# EAGLE design boardSchematic (EAGLE 9.3.0)
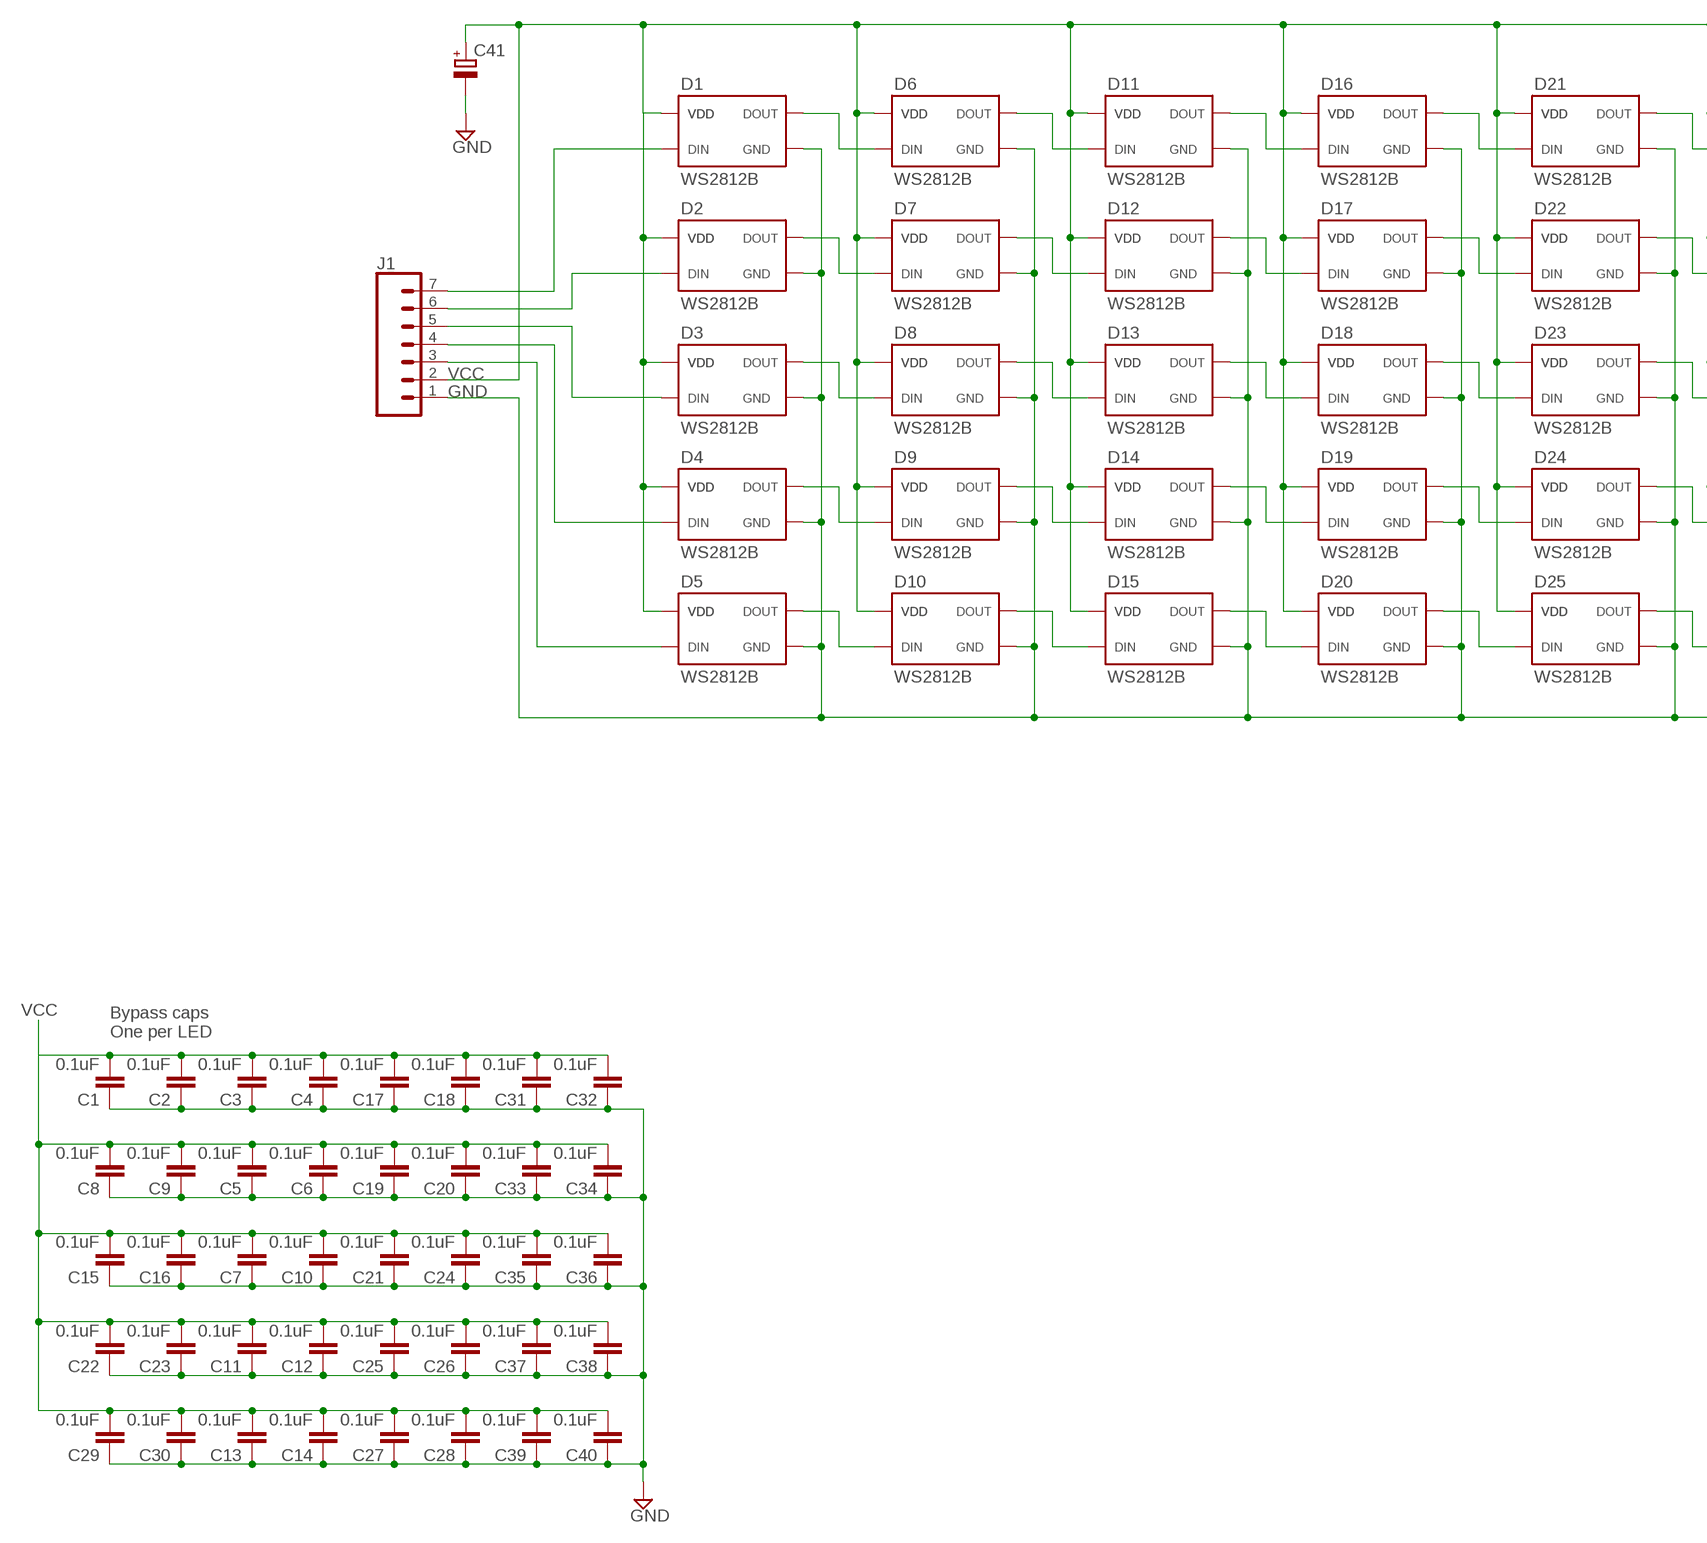
[diagram p0: schematic, sheet 1, part 1 of 2]
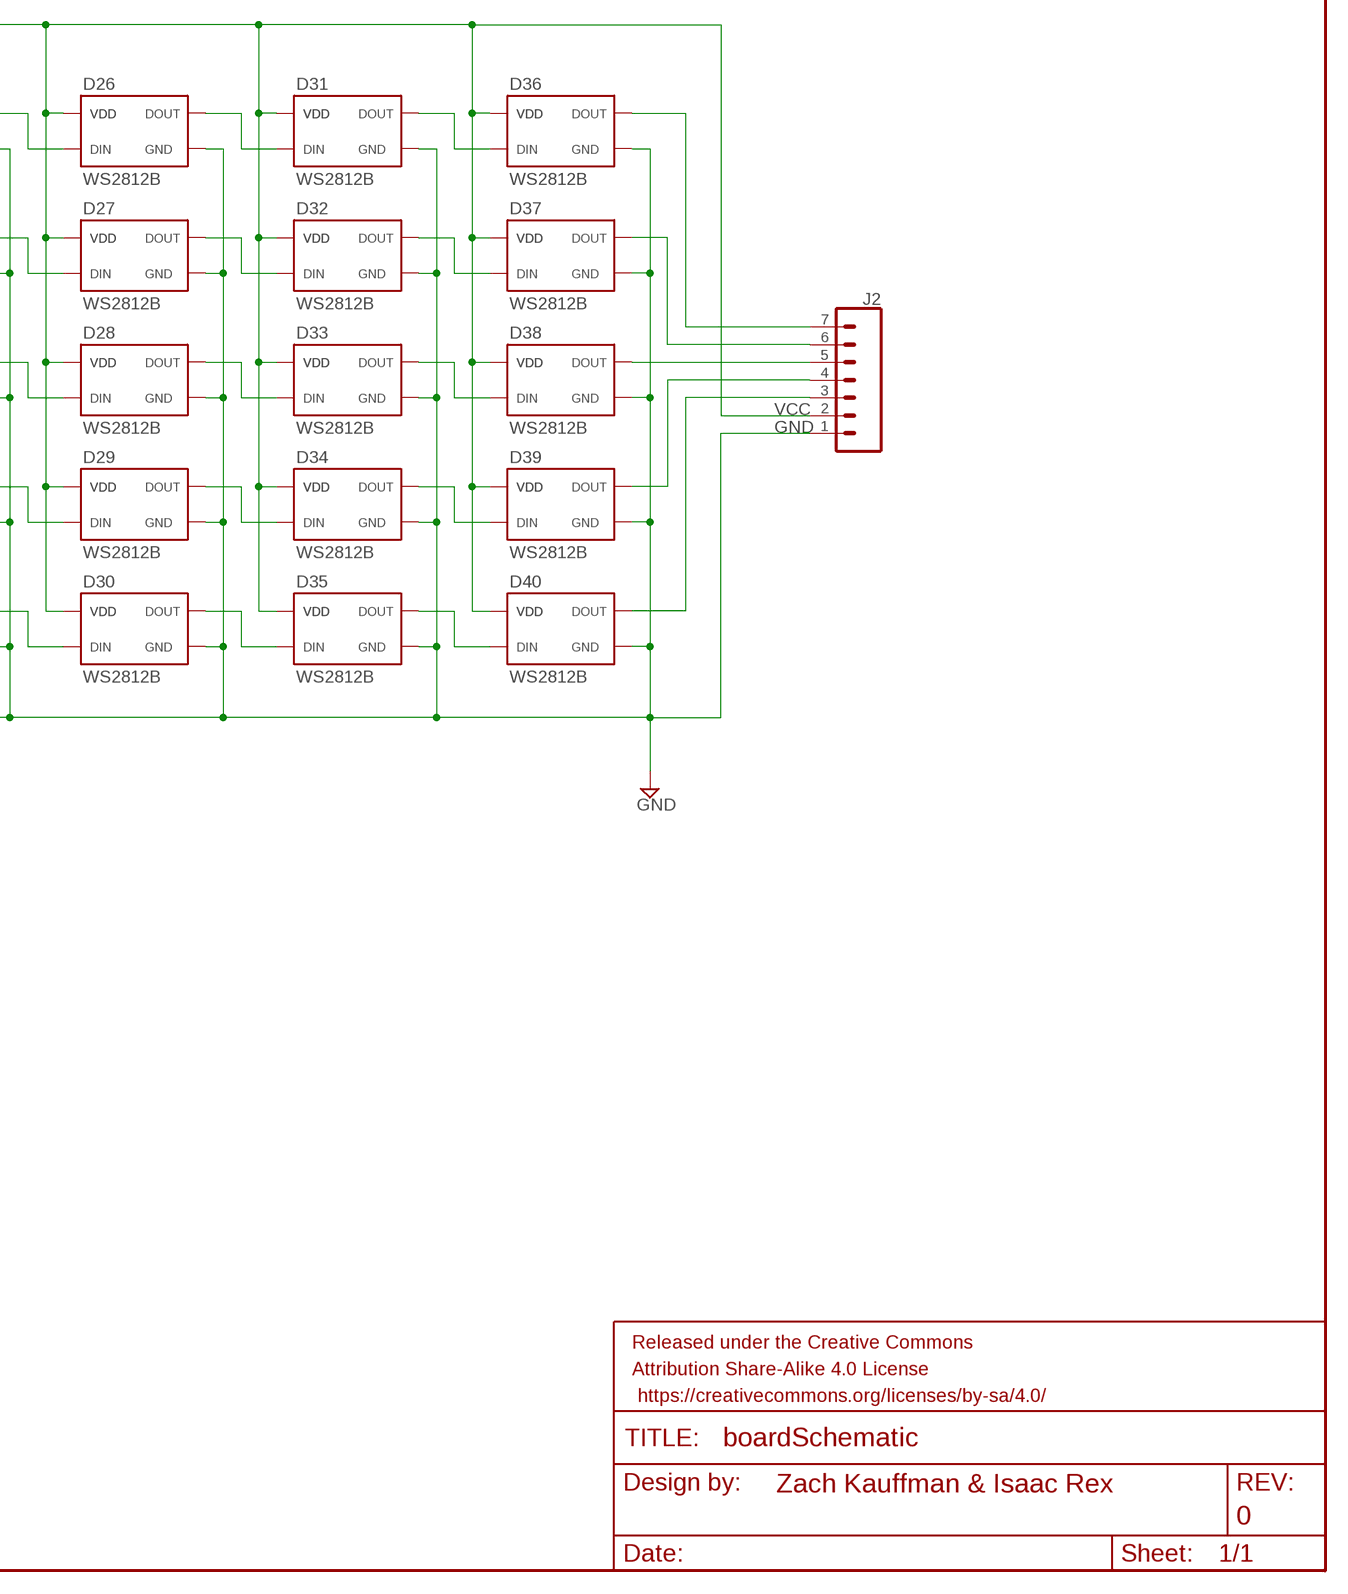
[diagram p1: schematic, sheet 1, part 2 of 2]

## Parts
C1  0.1uF  0.1UF-0603-25V-(+80/-20%)  [0603]
C2  0.1uF  0.1UF-0603-25V-(+80/-20%)  [0603]
C3  0.1uF  0.1UF-0603-25V-(+80/-20%)  [0603]
C4  0.1uF  0.1UF-0603-25V-(+80/-20%)  [0603]
C5  0.1uF  0.1UF-0603-25V-(+80/-20%)  [0603]
C6  0.1uF  0.1UF-0603-25V-(+80/-20%)  [0603]
C7  0.1uF  0.1UF-0603-25V-(+80/-20%)  [0603]
C8  0.1uF  0.1UF-0603-25V-(+80/-20%)  [0603]
C9  0.1uF  0.1UF-0603-25V-(+80/-20%)  [0603]
C10  0.1uF  0.1UF-0603-25V-(+80/-20%)  [0603]
C11  0.1uF  0.1UF-0603-25V-(+80/-20%)  [0603]
C12  0.1uF  0.1UF-0603-25V-(+80/-20%)  [0603]
C13  0.1uF  0.1UF-0603-25V-(+80/-20%)  [0603]
C14  0.1uF  0.1UF-0603-25V-(+80/-20%)  [0603]
C15  0.1uF  0.1UF-0603-25V-(+80/-20%)  [0603]
C16  0.1uF  0.1UF-0603-25V-(+80/-20%)  [0603]
C17  0.1uF  0.1UF-0603-25V-(+80/-20%)  [0603]
C18  0.1uF  0.1UF-0603-25V-(+80/-20%)  [0603]
C19  0.1uF  0.1UF-0603-25V-(+80/-20%)  [0603]
C20  0.1uF  0.1UF-0603-25V-(+80/-20%)  [0603]
C21  0.1uF  0.1UF-0603-25V-(+80/-20%)  [0603]
C22  0.1uF  0.1UF-0603-25V-(+80/-20%)  [0603]
C23  0.1uF  0.1UF-0603-25V-(+80/-20%)  [0603]
C24  0.1uF  0.1UF-0603-25V-(+80/-20%)  [0603]
C25  0.1uF  0.1UF-0603-25V-(+80/-20%)  [0603]
C26  0.1uF  0.1UF-0603-25V-(+80/-20%)  [0603]
C27  0.1uF  0.1UF-0603-25V-(+80/-20%)  [0603]
C28  0.1uF  0.1UF-0603-25V-(+80/-20%)  [0603]
C29  0.1uF  0.1UF-0603-25V-(+80/-20%)  [0603]
C30  0.1uF  0.1UF-0603-25V-(+80/-20%)  [0603]
C31  0.1uF  0.1UF-0603-25V-(+80/-20%)  [0603]
C32  0.1uF  0.1UF-0603-25V-(+80/-20%)  [0603]
C33  0.1uF  0.1UF-0603-25V-(+80/-20%)  [0603]
C34  0.1uF  0.1UF-0603-25V-(+80/-20%)  [0603]
C35  0.1uF  0.1UF-0603-25V-(+80/-20%)  [0603]
C36  0.1uF  0.1UF-0603-25V-(+80/-20%)  [0603]
C37  0.1uF  0.1UF-0603-25V-(+80/-20%)  [0603]
C38  0.1uF  0.1UF-0603-25V-(+80/-20%)  [0603]
C39  0.1uF  0.1UF-0603-25V-(+80/-20%)  [0603]
C40  0.1uF  0.1UF-0603-25V-(+80/-20%)  [0603]
C41  CPOL-EUE2-5  [E2-5]
D1  WS2812B  [5050]
D2  WS2812B  [5050]
D3  WS2812B  [5050]
D4  WS2812B  [5050]
D5  WS2812B  [5050]
D6  WS2812B  [5050]
D7  WS2812B  [5050]
D8  WS2812B  [5050]
D9  WS2812B  [5050]
D10  WS2812B  [5050]
D11  WS2812B  [5050]
D12  WS2812B  [5050]
D13  WS2812B  [5050]
D14  WS2812B  [5050]
D15  WS2812B  [5050]
D16  WS2812B  [5050]
D17  WS2812B  [5050]
D18  WS2812B  [5050]
D19  WS2812B  [5050]
D20  WS2812B  [5050]
D21  WS2812B  [5050]
D22  WS2812B  [5050]
D23  WS2812B  [5050]
D24  WS2812B  [5050]
D25  WS2812B  [5050]
D26  WS2812B  [5050]
D27  WS2812B  [5050]
D28  WS2812B  [5050]
D29  WS2812B  [5050]
D30  WS2812B  [5050]
D31  WS2812B  [5050]
D32  WS2812B  [5050]
D33  WS2812B  [5050]
D34  WS2812B  [5050]
D35  WS2812B  [5050]
D36  WS2812B  [5050]
D37  WS2812B  [5050]
D38  WS2812B  [5050]
D39  WS2812B  [5050]
D40  WS2812B  [5050]
FRAME1  FRAME-LEDGER  [CREATIVE_COMMONS]
J1  CONN_07LOCK_LONGPADS  [1X07_LOCK_LONGPADS]
J2  CONN_07LOCK_LONGPADS  [1X07_LOCK_LONGPADS]

## Nets
GND: C1.1 C2.1 C3.1 C4.1 C5.1 C6.1 C7.1 C8.1 C9.1 C10.1 C11.1 C12.1 C13.1 C14.1 C15.1 C16.1 C17.1 C18.1 C19.1 C20.1 C21.1 C22.1 C23.1 C24.1 C25.1 C26.1 C27.1 C28.1 C29.1 C30.1 C31.1 C32.1 C33.1 C34.1 C35.1 C36.1 C37.1 C38.1 C39.1 C40.1 C41.- D1.VSS(GND) D2.VSS(GND) D3.VSS(GND) D4.VSS(GND) D5.VSS(GND) D6.VSS(GND) D7.VSS(GND) D8.VSS(GND) D9.VSS(GND) D10.VSS(GND) D11.VSS(GND) D12.VSS(GND) D13.VSS(GND) D14.VSS(GND) D15.VSS(GND) D16.VSS(GND) D17.VSS(GND) D18.VSS(GND) D19.VSS(GND) D20.VSS(GND) D21.VSS(GND) D22.VSS(GND) D23.VSS(GND) D24.VSS(GND) D25.VSS(GND) D26.VSS(GND) D27.VSS(GND) D28.VSS(GND) D29.VSS(GND) D30.VSS(GND) D31.VSS(GND) D32.VSS(GND) D33.VSS(GND) D34.VSS(GND) D35.VSS(GND) D36.VSS(GND) D37.VSS(GND) D38.VSS(GND) D39.VSS(GND) D40.VSS(GND) J1.1 J2.1
N$1: D5.DOUT D10.DIN
N$2: D5.DIN J1.3
N$3: D4.DOUT D9.DIN
N$4: D1.DOUT D6.DIN
N$5: D10.DOUT D15.DIN
N$6: D2.DOUT D7.DIN
N$7: D3.DOUT D8.DIN
N$9: D9.DOUT D14.DIN
N$10: D6.DOUT D11.DIN
N$11: D7.DOUT D12.DIN
N$12: D8.DOUT D13.DIN
N$13: D4.DIN J1.4
N$14: D15.DOUT D20.DIN
N$15: D3.DIN J1.5
N$16: D14.DOUT D19.DIN
N$17: D11.DOUT D16.DIN
N$18: D12.DOUT D17.DIN
N$19: D13.DOUT D18.DIN
N$20: D2.DIN J1.6
N$21: D20.DOUT D25.DIN
N$22: D1.DIN J1.7
N$23: D19.DOUT D24.DIN
N$24: D16.DOUT D21.DIN
N$25: D17.DOUT D22.DIN
N$26: D18.DOUT D23.DIN
N$27: D37.DOUT J2.6
N$28: D25.DOUT D30.DIN
N$29: D36.DOUT J2.7
N$30: D24.DOUT D29.DIN
N$31: D21.DOUT D26.DIN
N$32: D22.DOUT D27.DIN
N$33: D23.DOUT D28.DIN
N$34: D38.DOUT J2.5
N$35: D30.DOUT D35.DIN
N$36: D39.DOUT J2.4
N$37: D29.DOUT D34.DIN
N$38: D26.DOUT D31.DIN
N$39: D27.DOUT D32.DIN
N$40: D28.DOUT D33.DIN
N$41: D40.DOUT J2.3
N$42: D35.DOUT D40.DIN
N$45: D34.DOUT D39.DIN
N$46: D31.DOUT D36.DIN
N$47: D32.DOUT D37.DIN
N$48: D33.DOUT D38.DIN
VCC: C1.2 C2.2 C3.2 C4.2 C5.2 C6.2 C7.2 C8.2 C9.2 C10.2 C11.2 C12.2 C13.2 C14.2 C15.2 C16.2 C17.2 C18.2 C19.2 C20.2 C21.2 C22.2 C23.2 C24.2 C25.2 C26.2 C27.2 C28.2 C29.2 C30.2 C31.2 C32.2 C33.2 C34.2 C35.2 C36.2 C37.2 C38.2 C39.2 C40.2 C41.+ D1.VDD D2.VDD D3.VDD D4.VDD D5.VDD D6.VDD D7.VDD D8.VDD D9.VDD D10.VDD D11.VDD D12.VDD D13.VDD D14.VDD D15.VDD D16.VDD D17.VDD D18.VDD D19.VDD D20.VDD D21.VDD D22.VDD D23.VDD D24.VDD D25.VDD D26.VDD D27.VDD D28.VDD D29.VDD D30.VDD D31.VDD D32.VDD D33.VDD D34.VDD D35.VDD D36.VDD D37.VDD D38.VDD D39.VDD D40.VDD J1.2 J2.2

## Notes on the sheet
- Bypass caps
  One per LED

## Library data of the parts
C1-C40 = SparkFun-Capacitors:0.1UF: 0.1µF ceramic capacitors A capacitor is a passive two-terminal electrical component used to store electrical energy temporarily in an electric field.; PROD_ID: CAP-00810
C41 = rcl:CPOL-EU: POLARIZED CAPACITOR, European symbol; SPICEPREFIX: C
D1-D40 = WS2812b:WS2812B
FRAME1 = SparkFun-Aesthetics:FRAME-LEDGER: Schematic Frame - Ledger Standard 11x14 US Ledger frame; DESIGNER: Zach Kauffman & Isaac Rex; REV: 0
J1 J2 = SparkFun-Connectors:CONN_07: Multi connection point. Often used as Generic Header-pin footprint for 0.1 inch spaced/style header connections On any of the 0.1 inch spaced packages, you can populate with these: Break Away Headers - Straight <https://www.sparkfun.com/products/116> (PRT-00116) Break Away Male Headers - Right Angle <https://www.sparkfun.com/products/553> (PRT-00553) Female Headers <https://www.sparkfun.com/products/115> (PRT-00115) Break Away Headers - Machine Pin <https://www.sparkfun.com/products/117> (PRT-00117) Break Away Female Headers - Swiss Machine Pin <https://www.sparkfun.com/products/743> (PRT-00743) For SCREWTERMINALS and SPRING TERMINALS visit here: Screw Terimnals on SparkFun.com <https://www.sparkfun.com/search/results?term=Screw+Terminals> (5mm/3.5mm/2.54mm spacing) This device is also useful as a general connection point to wire up your design to another part of your project. Our various solder wires solder well into these plated through hole pads. Hook-Up Wire - Assortment (Stranded, 22 AWG) <https://www.sparkfun.com/products/11375> (PRT-11375) Hook-Up Wire - Assortment (Solid Core, 22 AWG) <https://www.sparkfun.com/products/11367> (PRT-11367) View the entire wire category on our website here <https://www.sparkfun.com/categories/141> Special notes: Molex polarized connector foot print use with SKU : PRT-08231 with associated crimp pins and housings. 1MM SMD Version SKU: PRT-10208 NOTES ON THE VARIANTS LOCK and LOCK_LONGPADS... This footprint was designed to help hold the alignment of a through-hole component (i.e. 6-pin header) while soldering it into place. You may notice that each hole has been shifted either up or down by 0.005 of an inch from it's more standard position (which is a perfectly straight line). This slight alteration caused the pins (the squares in the middle) to touch the edges of the holes. Because they are alternating, it causes a "brace" to hold the component in place. 0.005 has proven to be the perfect amount of "off-center" position when using our standard breakaway headers. Although looks a little odd when you look at the bare footprint, once you have a header in there, the alteration is very hard to notice. Also,if you push a header all the way into place, it is covered up entirely on the bottom side.

## Board
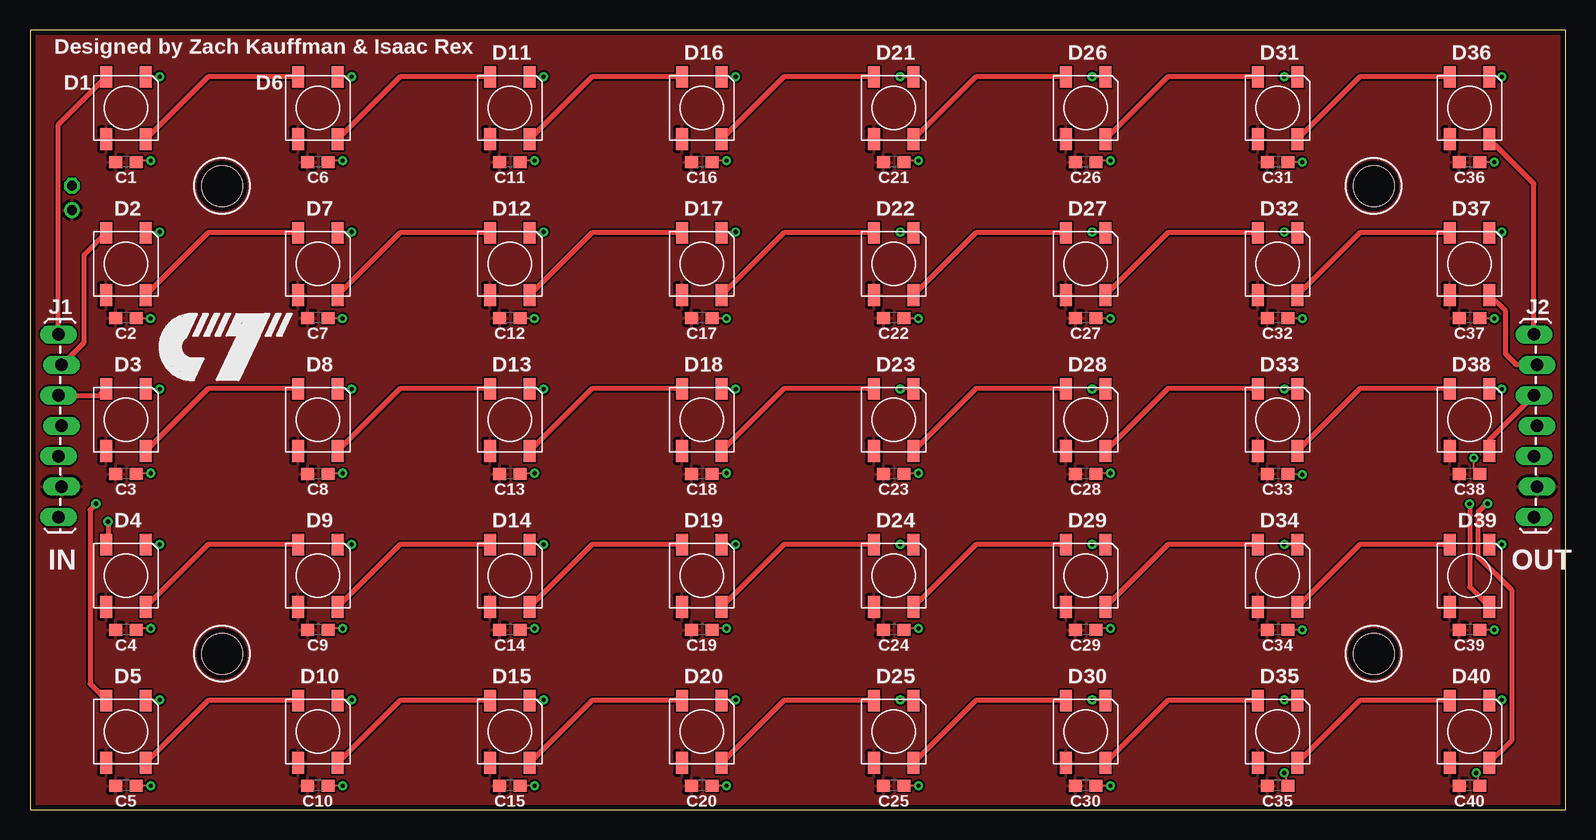
[diagram p2: board, top side]
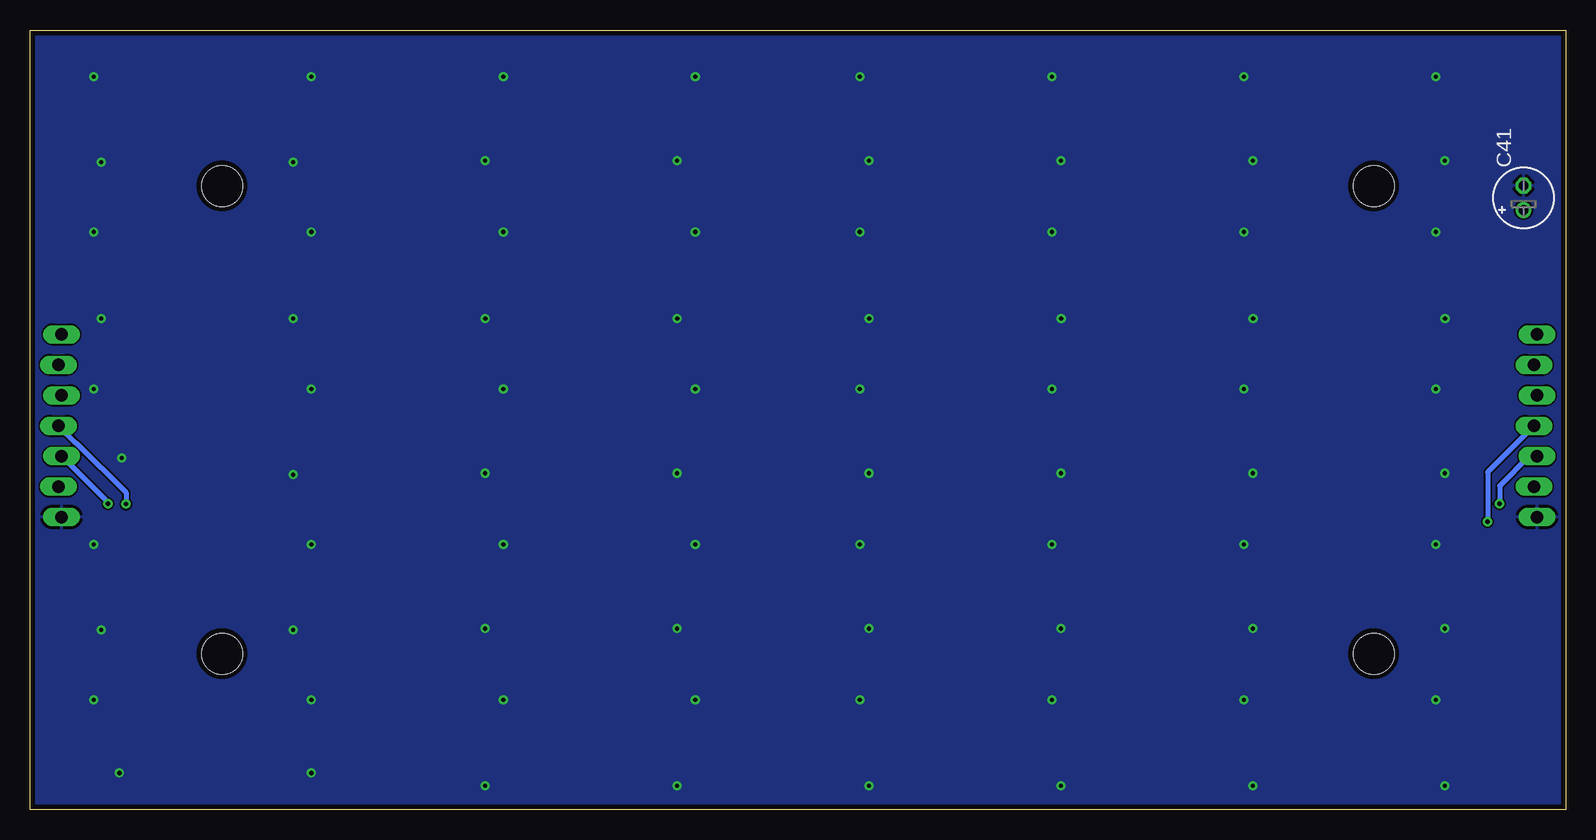
[diagram p3: board, bottom side, seen from below]

Size 128 x 65 mm. Coordinates in mm from the lower left corner, seen from the top.
Outline: 0,0 128,0 128,65 0,65 0,0
Copper layers (1*16): Top 0.035mm / dielectric 1.5mm / Bottom 0.035mm
Design rules "default *": minimum track width 6mil, minimum drill 0.35mm, track to track 6mil, track to pad 6mil, pad to pad 6mil, via to via 6mil, smd to smd 6mil, copper to edge 16mil, drill to drill 6mil, minimum pad ring 10mil, minimum via ring 8mil, stop-mask expansion 4mil, vias tented up to drill 0mil, thermal gap 10mil
Holes 3.4 mm at 16,13 16,52 112,52 112,13

### Footprints (pad centres in the part's own frame; a part is rotated, then mirrored left to right if it is on the bottom)
0603 = smd 1.1 x 1: 1 -0.85,0; 2 0.85,0
E2-5 = drill 0.813 pad 1.27: + -1.016,0 | drill 0.813 pad 1.27 octagon: - 1.016,0
5050 = smd 1.8 x 1: DIN 2.6,1.65; DOUT -2.6,-1.65; VDD -2.6,1.65; VSS 2.6,-1.65
1X07_LOCK_LONGPADS = drill 1.016 long: 1 0,0.127; 2 2.54,-0.127; 3 5.08,0.127; 4 7.62,-0.127; 5 10.16,0.127; 6 12.7,-0.127; 7 15.24,0.127

### Placement (x,y rotation side)
C1  8,54 180 top
C2  8,41 180 top
C3  8,28 180 top
C4  8,15 180 top
C5  8,2 180 top
C6  24,54 180 top
C7  24,41 180 top
C8  24,28 180 top
C9  24,15 180 top
C10  24,2 180 top
C11  40,54 180 top
C12  40,41 180 top
C13  40,28 180 top
C14  40,15 180 top
C15  40,2 180 top
C16  56,54 180 top
C17  56,41 180 top
C18  56,28 180 top
C19  56,15 180 top
C20  56,2 180 top
C21  72,54 180 top
C22  72,41 180 top
C23  72,28 180 top
C24  72,15 180 top
C25  72,2 180 top
C26  88,54 180 top
C27  88,41 180 top
C28  88,28 180 top
C29  88,15 180 top
C30  88,2 180 top
C31  104,54 180 top
C32  104,41 180 top
C33  104,28 180 top
C34  104,15 180 top
C35  104,2 180 top
C36  120,54 180 top
C37  120,41 180 top
C38  120,28 180 top
C39  120,15 180 top
C40  120,2 180 top
C41  3.5,51 90 bottom
D1  8,58.5 90 top
D2  8,45.5 90 top
D3  8,32.5 90 top
D4  8,19.5 90 top
D5  8,6.5 90 top
D6  24,58.5 90 top
D7  24,45.5 90 top
D8  24,32.5 90 top
D9  24,19.5 90 top
D10  24,6.5 90 top
D11  40,58.5 90 top
D12  40,45.5 90 top
D13  40,32.5 90 top
D14  40,19.5 90 top
D15  40,6.5 90 top
D16  56,58.5 90 top
D17  56,45.5 90 top
D18  56,32.5 90 top
D19  56,19.5 90 top
D20  56,6.5 90 top
D21  72,58.5 90 top
D22  72,45.5 90 top
D23  72,32.5 90 top
D24  72,19.5 90 top
D25  72,6.5 90 top
D26  88,58.5 90 top
D27  88,45.5 90 top
D28  88,32.5 90 top
D29  88,19.5 90 top
D30  88,6.5 90 top
D31  104,58.5 90 top
D32  104,45.5 90 top
D33  104,32.5 90 top
D34  104,19.5 90 top
D35  104,6.5 90 top
D36  120,58.5 90 top
D37  120,45.5 90 top
D38  120,32.5 90 top
D39  120,19.5 90 top
D40  120,6.5 90 top
FRAME1  -80.01,62.23 0 top  (outside the outline)
J1  2.5,24.38 90 top
J2  125.5,24.38 90 top

### Tracks (layer width: path | path; a pad name or v marks a point on that pad's centre or on a via)
GND  (via drill 0.35)
  Top 0.152: v10.06,1.98 8.99,1.98 C5.1 | v10.06,15.09 8.99,15.09 C4.1 | v26.06,1.98 24.99,1.98 C10.1 | v10.06,28.04 8.99,28.04 C3.1 | v26.06,15.09 24.99,15.09 C9.1 | v42.06,1.98 41,1.98 C15.1 | v10.04,40.93 8.92,40.93 C2.1 | v26.06,28.04 24.99,28.04 C8.1 | v42.06,15.09 41,15.09 C14.1 | v58.06,1.98 57,1.98 C20.1 | v10.06,54.1 8.99,54.1 C1.1 | v26.04,40.93 24.92,40.93 C7.1 | v42.06,28.04 41,28.04 C13.1 | v58.06,15.09 57,15.09 C19.1 | v74.07,1.98 73,1.98 C25.1 | v26.06,54.1 24.99,54.1 C6.1 | v42.04,40.93 40.92,40.93 C12.1 | v74.07,15.09 73,15.09 C24.1 | v58.06,28.04 57,28.04 C18.1 | v90.07,1.98 89,1.98 C30.1 | v42.06,54.1 41,54.1 C11.1 | v58.05,40.93 56.92,40.93 C17.1 | v90.07,15.09 89,15.09 C29.1 | v74.07,28.04 73,28.04 C23.1 | v104.55,3.05 104.7,2.9 104.7,2.13 C35.1 | v58.06,54.1 57,54.1 C16.1 | v74.05,40.93 72.92,40.93 C22.1 | v90.07,28.04 89,28.04 C28.1 | v106.05,14.97 104.88,14.97 C34.1 | v120.55,3.05 120.7,2.9 120.7,2.13 C40.1 | v74.07,54.1 73,54.1 C21.1 | v90.05,40.93 88.92,40.93 C27.1 | v122.05,14.97 120.88,14.97 C39.1 | v106.05,27.92 104.88,27.92 104.85,27.89 C33.1 | v90.07,54.1 89,54.1 C26.1 | v106.05,40.93 104.92,40.93 C32.1 | v120.35,29.32 120.35,28.5 C38.1 | v106.05,53.98 104.87,53.98 C31.1 | v122.05,40.93 120.92,40.93 C37.1 | v122.05,53.98 120.87,53.98 C36.1 | v10.82,9.14 9.75,9.14 D5.VSS | v10.82,22.1 9.75,22.1 D4.VSS | v26.82,9.14 25.76,9.14 D10.VSS | v10.82,35.05 9.75,35.05 D3.VSS | v26.82,22.1 25.76,22.1 D9.VSS | v42.82,9.14 41.76,9.14 D15.VSS | v10.82,48.16 9.75,48.16 D2.VSS | v26.82,35.05 25.76,35.05 D8.VSS | v42.82,22.1 41.76,22.1 D14.VSS | v58.83,9.14 57.76,9.14 D20.VSS | v10.82,61.11 9.75,61.11 D1.VSS | v26.82,48.16 25.76,48.16 D7.VSS
  Top 0.152: v42.82,35.05 41.76,35.05 D13.VSS | v58.83,22.1 57.76,22.1 D19.VSS | v72.54,9.14 73.61,9.14 D25.VSS | v26.82,61.11 25.76,61.11 D6.VSS | v42.82,48.16 41.76,48.16 D12.VSS | v58.83,35.05 57.76,35.05 D18.VSS | v72.54,22.1 73.61,22.1 D24.VSS | v88.54,9.14 89.61,9.14 D30.VSS | v42.82,61.11 41.76,61.11 D11.VSS | v58.83,48.16 57.76,48.16 D17.VSS | v72.54,35.05 73.61,35.05 D23.VSS | v88.54,22.1 89.61,22.1 D29.VSS | v104.55,9.14 105.61,9.14 D35.VSS | v58.83,61.11 57.76,61.11 D16.VSS | v72.54,48.16 73.61,48.16 D22.VSS | v88.54,35.05 89.61,35.05 D28.VSS | v104.55,22.1 105.61,22.1 D34.VSS | v122.68,9.14 121.77,9.14 D40.VSS | v72.54,61.11 73.61,61.11 D21.VSS | v88.54,48.16 89.61,48.16 D27.VSS | v104.55,35.05 105.61,35.05 D33.VSS | v122.68,22.1 121.77,22.1 D39.VSS | v88.54,61.11 89.61,61.11 D26.VSS | v104.55,48.16 105.61,48.16 D32.VSS | v122.68,35.05 121.77,35.05 D38.VSS | v104.55,61.11 105.61,61.11 D31.VSS | v122.68,48.16 121.77,48.16 D37.VSS | v122.68,61.11 121.77,61.11 D36.VSS
  pour Bottom: 0,0 0,65 128,65 128,0
N$1
  Top 0.406: D10.DIN 14.85,9.1 D5.DOUT
N$2  (via drill 0.35)
  Top 0.406: D5.DIN 6.35,9.15 5,10.5 5,25 v5.5,25.5
  Bottom 0.406: J1.3 3.04,29.46 5.5,27 v5.5,25.5
N$3
  Top 0.406: D9.DIN 14.85,22.1 D4.DOUT
N$4
  Top 0.406: D6.DIN 14.85,61.1 D1.DOUT
N$5
  Top 0.406: D15.DIN 30.85,9.1 D10.DOUT
N$6
  Top 0.406: D7.DIN 14.85,48.1 D2.DOUT
N$7
  Top 0.406: D8.DIN 14.85,35.1 D3.DOUT
N$9
  Top 0.406: D14.DIN 30.85,22.1 D9.DOUT
N$10
  Top 0.406: D11.DIN 30.85,61.1 D6.DOUT
N$11
  Top 0.406: D12.DIN 30.85,48.1 D7.DOUT
N$12
  Top 0.406: D13.DIN 30.85,35.1 D8.DOUT
N$13  (via drill 0.35)
  Top 0.406: D4.DIN 6.22,22.23 6.5,22.5 v6.5,24
  Bottom 0.406: J1.4 6.5,28.13 v6.5,24
N$14
  Top 0.406: D20.DIN 46.85,9.1 D15.DOUT
N$15
  Top 0.406: J1.5 5.79,34.54 D3.DIN
N$16
  Top 0.406: D19.DIN 46.85,22.1 D14.DOUT
N$17
  Top 0.406: D16.DIN 46.85,61.1 D11.DOUT
N$18
  Top 0.406: D17.DIN 46.85,48.1 D12.DOUT
N$19
  Top 0.406: D18.DIN 46.85,35.1 D13.DOUT
N$20
  Top 0.406: J1.6 4.5,38.95 4.5,46.25 D2.DIN
N$21
  Top 0.406: D25.DIN 62.85,9.1 D20.DOUT
N$22
  Top 0.406: J1.7 2.37,57.12 D1.DIN
N$23
  Top 0.406: D24.DIN 62.85,22.1 D19.DOUT
N$24
  Top 0.406: D21.DIN 62.85,61.1 D16.DOUT
N$25
  Top 0.406: D22.DIN 62.85,48.1 D17.DOUT
N$26
  Top 0.406: D23.DIN 62.85,35.1 D18.DOUT
N$27
  Top 0.406: J2.6 123.92,37.08 123,38 123,41.55 D37.DOUT
N$28
  Top 0.406: D30.DIN 78.85,9.1 D25.DOUT
N$29
  Top 0.406: J2.7 125.37,52.18 D36.DOUT
N$30
  Top 0.406: D29.DIN 78.85,22.1 D24.DOUT
N$31
  Top 0.406: D26.DIN 78.85,61.1 D21.DOUT
N$32
  Top 0.406: D27.DIN 78.85,48.1 D22.DOUT
N$33
  Top 0.406: D28.DIN 78.85,35.1 D23.DOUT
N$34
  Top 0.406: D38.DOUT 121.65,30.82 J2.5
N$35
  Top 0.406: D35.DIN 94.85,9.1 D30.DOUT
N$36  (via drill 0.35)
  Top 0.406: D39.DOUT 120,18.55 v120,25.47
  Bottom 0.406: J2.4 124.2,30.58 124.15,30.58 120,26.43 v120,25.47
N$37
  Top 0.406: D34.DIN 94.85,22.1 D29.DOUT
N$38
  Top 0.406: D31.DIN 94.85,61.1 D26.DOUT
N$39
  Top 0.406: D32.DIN 94.85,48.1 D27.DOUT
N$40
  Top 0.406: D33.DIN 94.85,35.1 D28.DOUT
N$41  (via drill 0.35)
  Top 0.406: D40.DOUT 123.5,5.75 123.5,18.3 120.7,21.1 120.7,24.79 121.41,25.5 v121.5,25.5
  Bottom 0.406: J2.3 121.5,25.59 v121.5,25.5
N$42
  Top 0.406: D40.DIN 110.85,9.1 D35.DOUT
N$45
  Top 0.406: D39.DIN 110.85,22.1 D34.DOUT
N$46
  Top 0.406: D36.DIN 110.85,61.1 D31.DOUT
N$47
  Top 0.406: D37.DIN 110.85,48.1 D32.DOUT
N$48
  Top 0.406: D38.DIN 110.85,35.1 D33.DOUT
VCC
  pour Top: 0,0 0,65 128,65 128,0

### Text on the board
tPlace: Designed by Zach Kauffman & Isaac Rex | IN | OUT